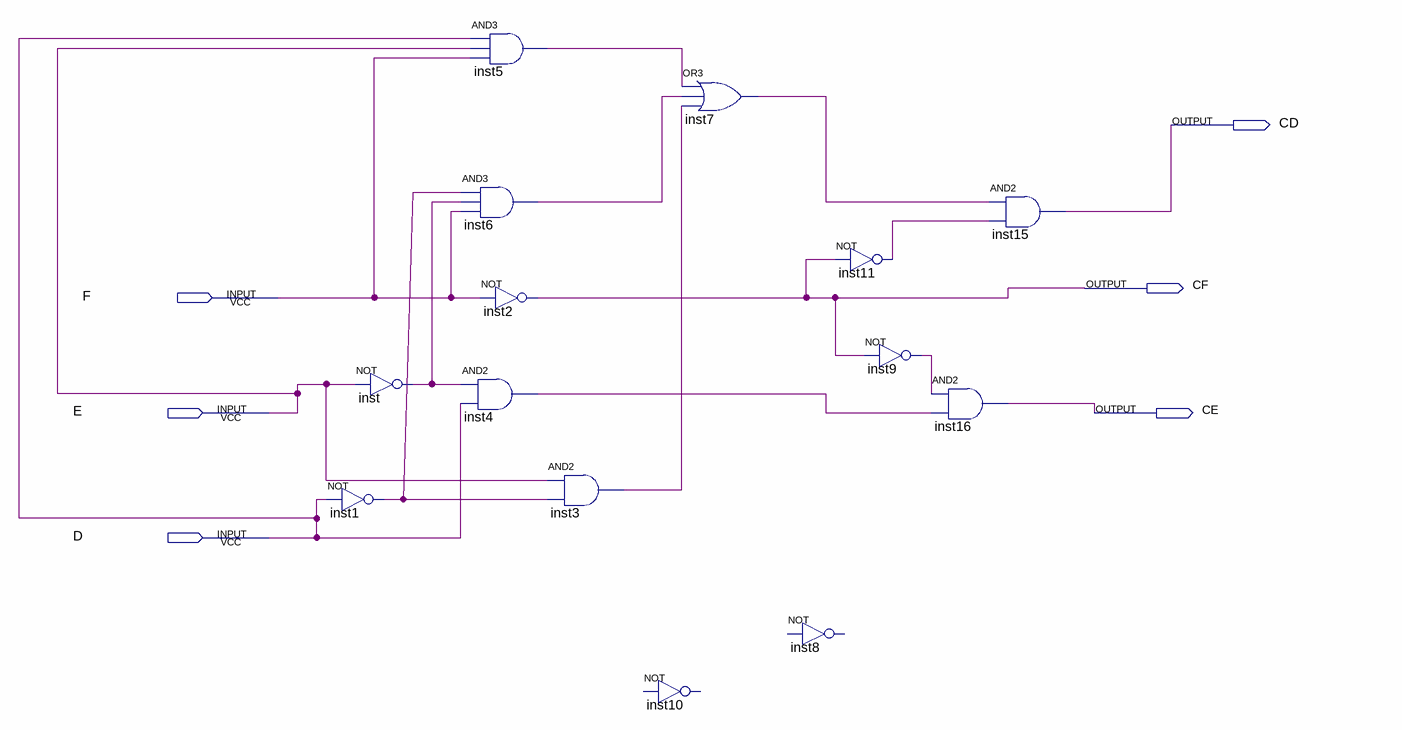
[diagram p0: schematic sheet]
// Quartus schematic exercicio3.bdf as structural Verilog: 14 symbols, 6 pins
module exercicio3 (
  input  F,
  input  E,
  input  D,
  output CD,
  output CF,
  output CE
);

  wire inst1_out, inst3_out, inst4_out, inst5_out, inst6_out, inst7_out, inst9_out, inst11_out, inst_out;

  not inst1 (inst1_out, D);
  not inst (inst_out, E);
  and inst5 (inst5_out, D, E, F);
  and inst6 (inst6_out, inst1_out, inst_out, F);
  not inst2 (CF, F);
  and inst4 (inst4_out, inst_out, D);
  and inst3 (inst3_out, E, inst1_out);
  // NOT inst10 is placed but not wired
  or inst7 (inst7_out, inst5_out, inst6_out, inst3_out);
  // NOT inst8 is placed but not wired
  not inst11 (inst11_out, CF);
  not inst9 (inst9_out, CF);
  and inst16 (CE, inst9_out, inst4_out);
  and inst15 (CD, inst7_out, inst11_out);
endmodule
